# EAGLE schematic version 2 (EAGLE 6.1)

## Sheet 1 of 2
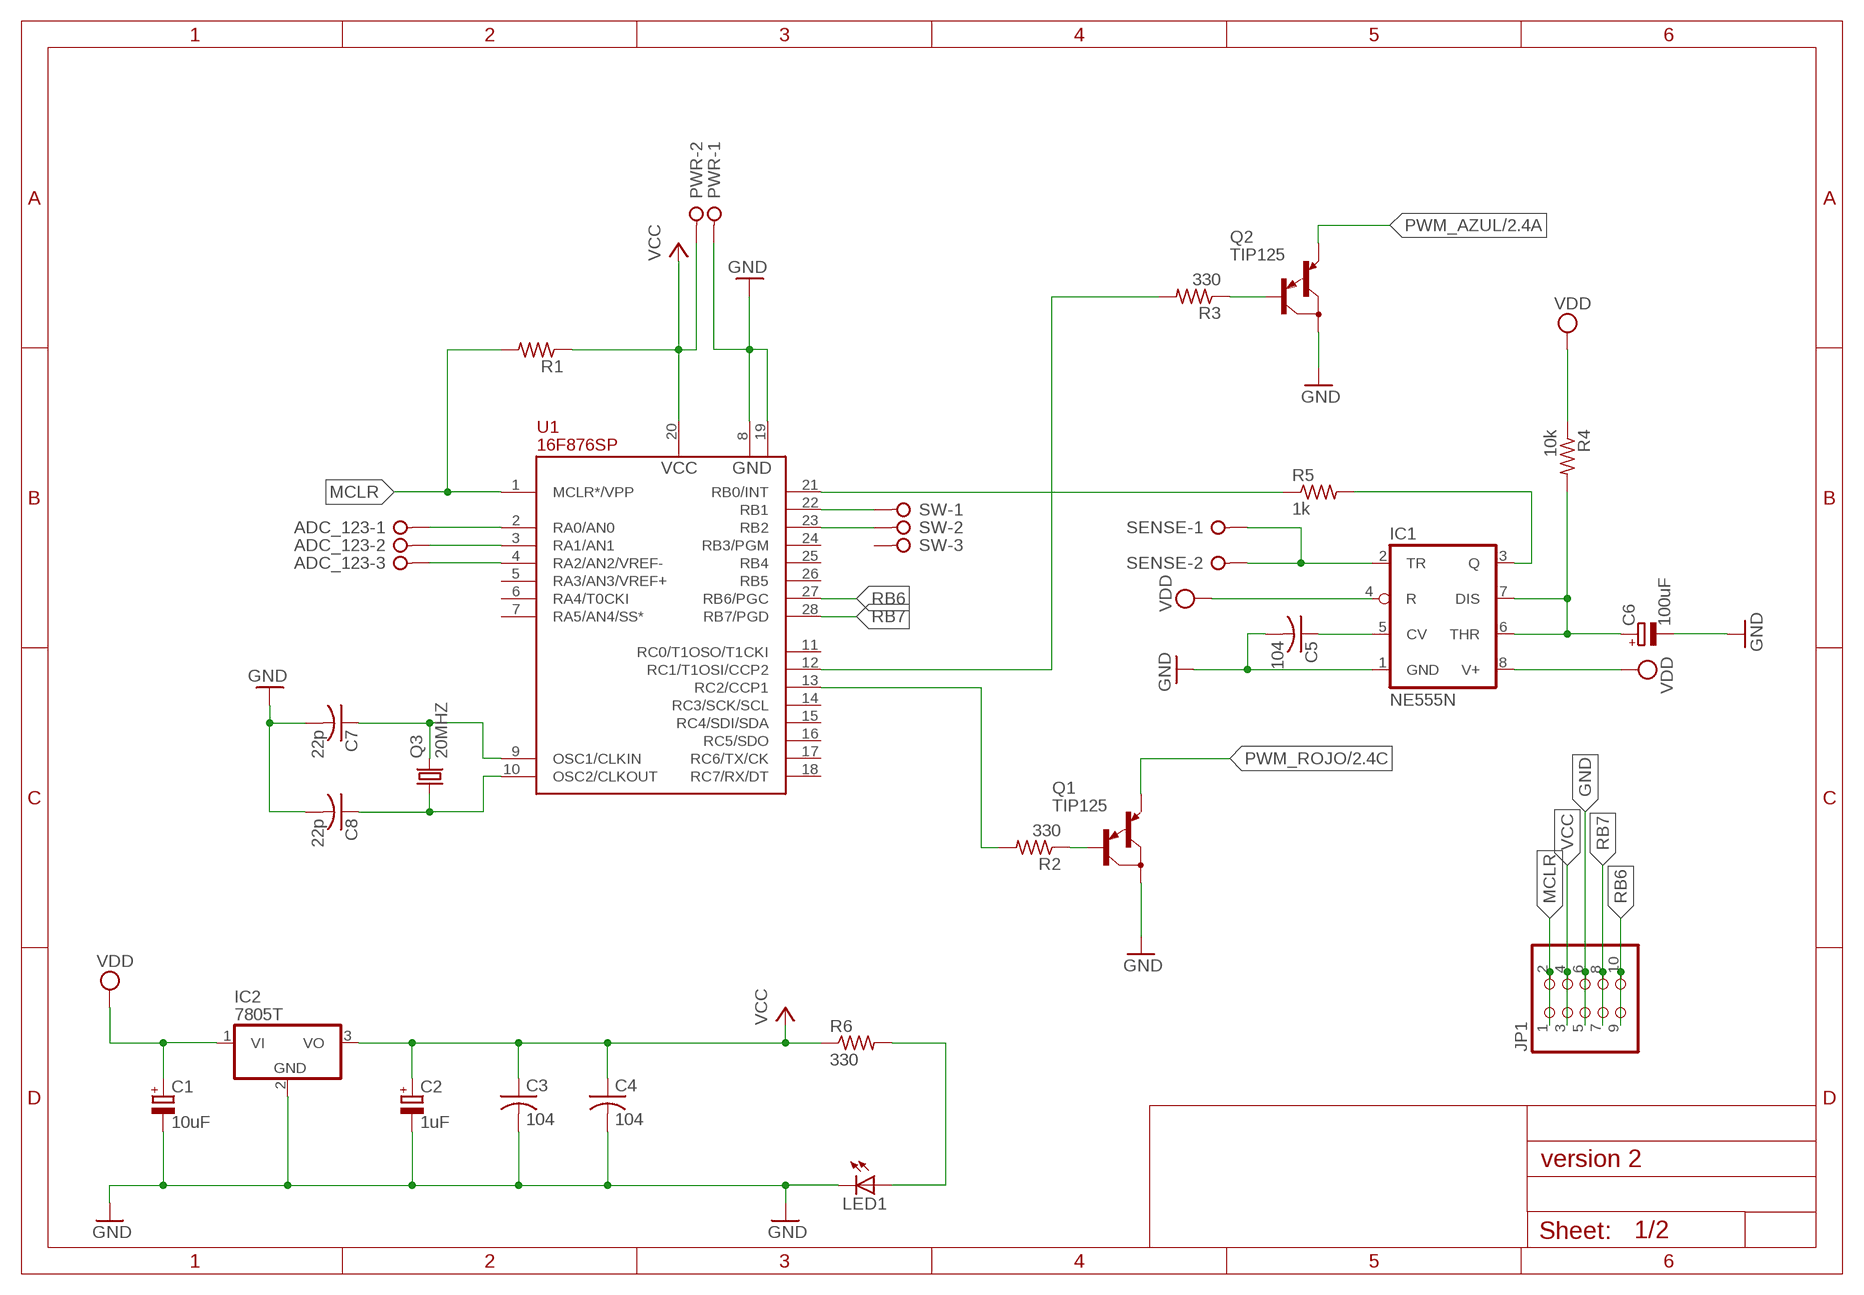
[diagram p0: schematic, sheet 1]

### Parts
ADC_123  W237-03P  [W237-133]
C1  10uF  CPOL-EUE2.5-6  [E2,5-6]
C2  1uF  CPOL-EUE2.5-6  [E2,5-6]
C3  104  C-US025-024X044  [C025-024X044]
C4  104  C-US025-024X044  [C025-024X044]
C5  104  C-US025-024X044  [C025-024X044]
C6  100uF  CPOL-EUE2.5-6  [E2,5-6]
C7  22p  C-US025-024X044  [C025-024X044]
C8  22p  C-US025-024X044  [C025-024X044]
IC1  NE555N  [DIL08]
IC2  7805T  [TO220H]
JP1  PINHD-2X5  [2X05]
LED1  LED3MM  [LED3MM]
PWR  W237-02P  [W237-132]
Q1  TIP125  [TO220]
Q2  TIP125  [TO220]
Q3  20MHZ  CRYSTALHC49S  [HC49/S]
R1  R-US_0204/7  [0204/7]
R2  330  R-US_0204/7  [0204/7]
R3  330  R-US_0204/7  [0204/7]
R4  10k  R-US_0204/7  [0204/7]
R5  1k  R-US_0204/7  [0204/7]
R6  330  R-US_0204/7  [0204/7]
SENSE  W237-02P  [W237-132]
SW  W237-03P  [W237-133]
U1  16F876SP  [DIL28-3]

### Nets
GND: C1.- C2.- C3.2 C4.2 C5.2 C6.- C7.2 C8.2 IC1.1(GND) IC2.2(GND) JP1.5 JP1.6 LED1.K(C) PWR.1 Q1.2(C) Q2.2(C) U1.8(GND) U1.19(GND) ; also sheet 2
MCLR: JP1.1 JP1.2 R1.2 U1.1(MCLR*/VPP)
N$1: C5.1 IC1.5(CV)
N$5: R2.2 U1.13(RC2/CCP1)
N$6: C6.+ IC1.6(THR) IC1.7(DIS) R4.2
N$7: IC1.3(Q) R5.2
N$8: R5.1 U1.21(RB0/INT)
N$9: Q1.1(B) R2.1
N$10: IC1.2(TR) SENSE.1 SENSE.2
N$11: R3.2 U1.12(RC1/T1OSI/CCP2)
N$12: Q2.1(B) R3.1
N$13: SW.1 U1.22(RB1)
N$14: SW.2 U1.23(RB2)
N$16: ADC_123.1 U1.2(RA0/AN0)
N$17: ADC_123.2 U1.3(RA1/AN1)
N$18: ADC_123.3 U1.4(RA2/AN2/VREF-)
N$21: LED1.A R6.2
N$23: C7.1 Q3.2 U1.9(OSC1/CLKIN)
N$24: C8.1 Q3.1 U1.10(OSC2/CLKOUT)
PWM_AZUL: Q2.3(E) ; also sheet 2
PWM_ROJO: Q1.3(E) ; also sheet 2
RB6: JP1.9 JP1.10 U1.27(RB6/PGC)
RB7: JP1.7 JP1.8 U1.28(RB7/PGD)
VCC: C2.+ C3.1 C4.1 IC2.3(VO) JP1.3 JP1.4 PWR.2 R1.1 R6.1 U1.20(VCC)
VDD: C1.+ IC1.4(R) IC1.8(V+) IC2.1(VI) R4.1 ; also sheet 2
Unconnected: SW.3 U1.5(RA3/AN3/VREF+) U1.6(RA4/T0CKI) U1.7(RA5/AN4/SS*) U1.11(RC0/T1OSO/T1CKI) U1.14(RC3/SCK/SCL) U1.15(RC4/SDI/SDA) U1.16(RC5/SDO) U1.17(RC6/TX/CK) U1.18(RC7/RX/DT) U1.24(RB3/PGM) U1.25(RB4) U1.26(RB5)

## Sheet 2 of 2
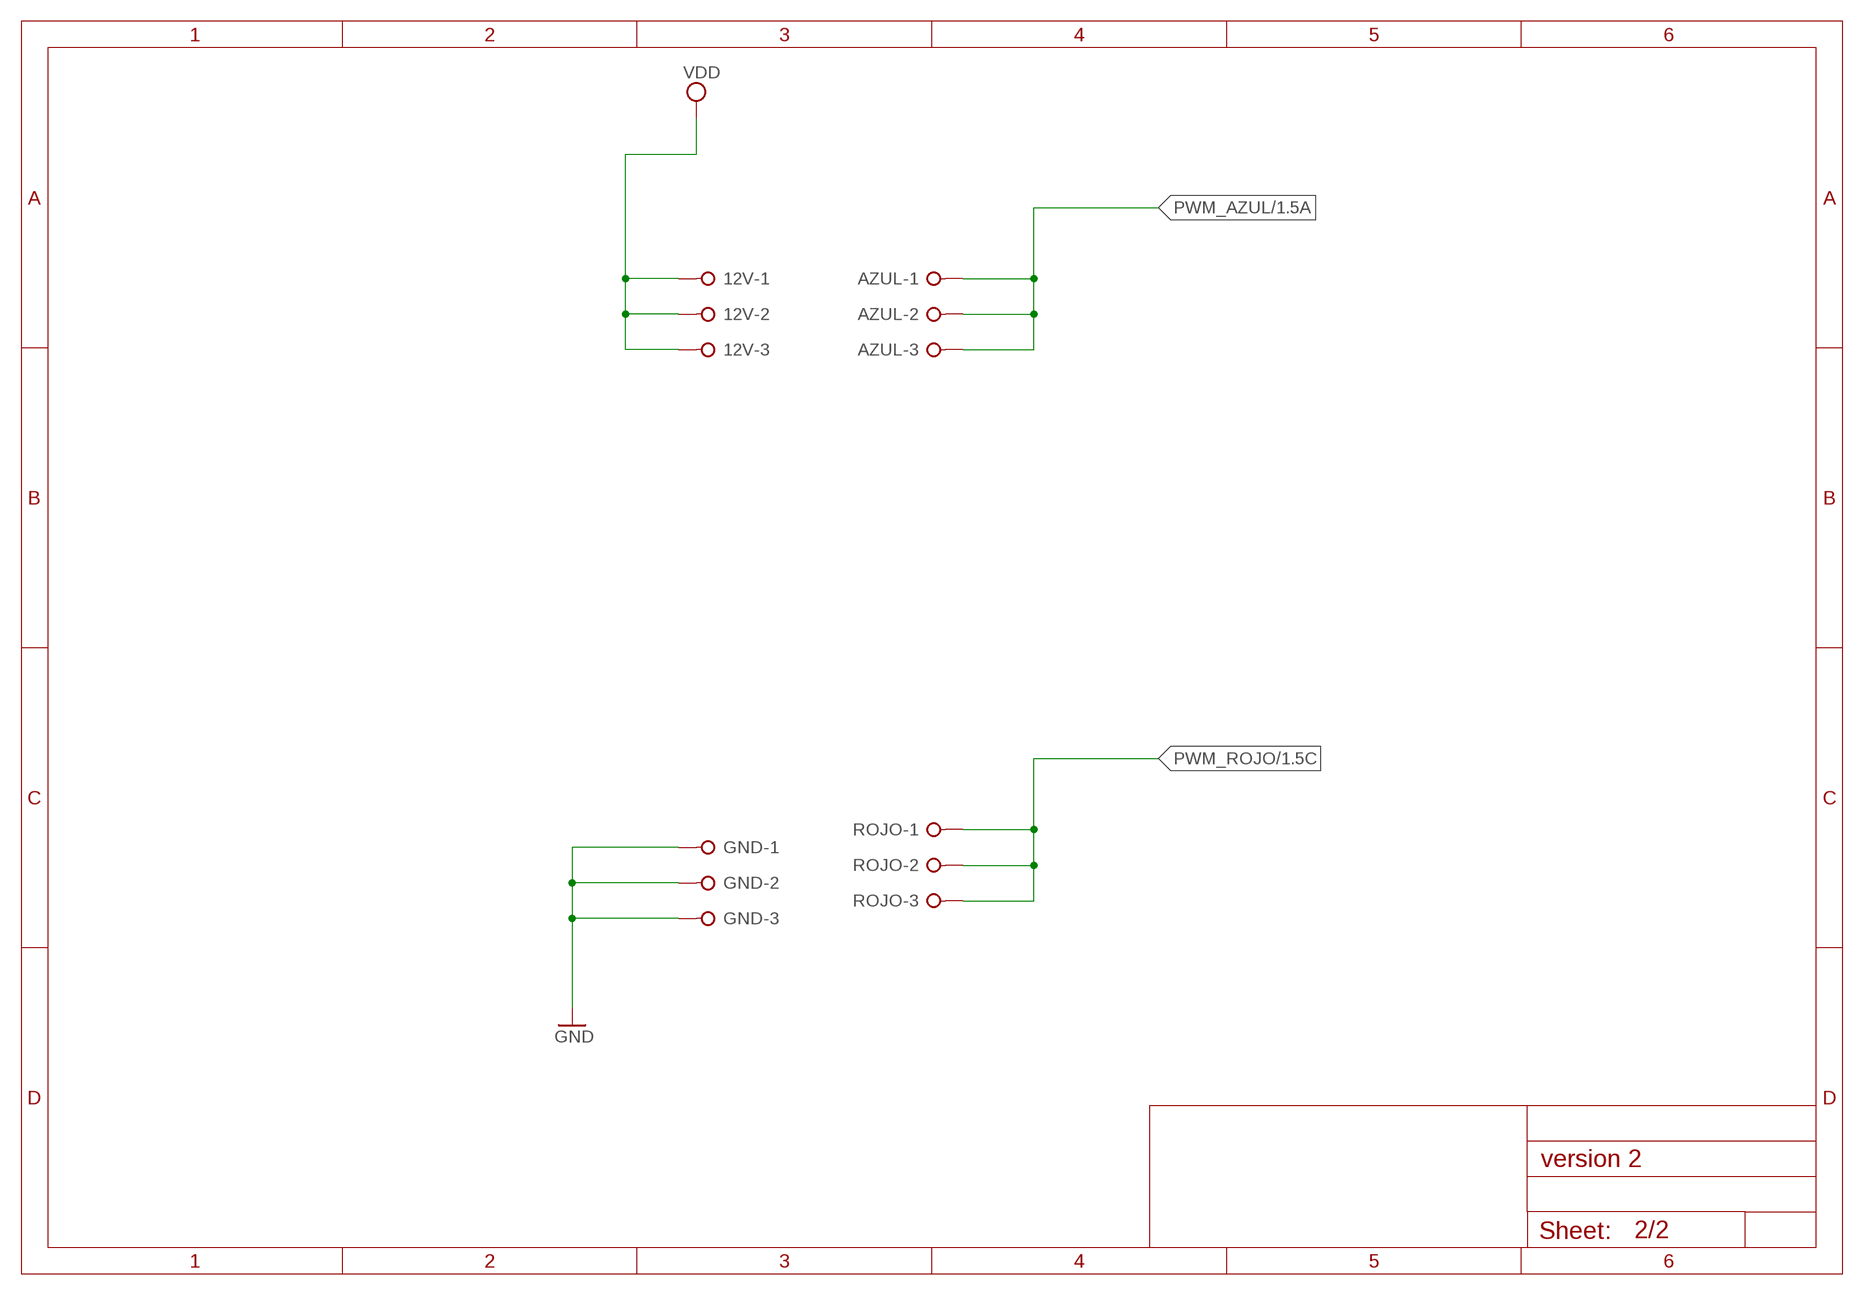
[diagram p1: schematic, sheet 2]

### Parts
12V  W237-03P  [W237-133]
AZUL  W237-03P  [W237-133]
GND  W237-03P  [W237-133]
ROJO  W237-03P  [W237-133]

### Nets
GND: GND.1 GND.2 GND.3 ; also sheet 1
PWM_AZUL: AZUL.1 AZUL.2 AZUL.3 ; also sheet 1
PWM_ROJO: ROJO.1 ROJO.2 ROJO.3 ; also sheet 1
VDD: 12V.1 12V.2 12V.3 ; also sheet 1

## Library data of the parts
12V ADC_123 AZUL GND ROJO SW = con-wago-508:W237-03P: WAGO SREW CLAMP; OC_FARNELL: unknown; OC_NEWARK: unknown
C1 C2 C6 = rcl:CPOL-EU: POLARIZED CAPACITOR, European symbol
C3-C5 C7 C8 = rcl:C-US: CAPACITOR, American symbol
IC1 = baiyun:*555: TIMER
IC2 = linear:78*: Positive VOLTAGE REGULATOR Source: http://cache.national.com/ds/LM/LM78L05.pdf http://www.fairchildsemi.com/ds/LM/LM7805.pdf
JP1 = pinhead:PINHD-2X5: PIN HEADER
LED1 = led:LED: LED OSRAM: - CHIPLED LG R971, LG N971, LY N971, LG Q971, LY Q971, LO R971, LY R971 LH N974, LH R974 LS Q976, LO Q976, LY Q976 LO Q996 - Hyper CHIPLED LW Q18S LB Q993, LB Q99A, LB R99A - SideLED LS A670, LO A670, LY A670, LG A670, LP A670 LB A673, LV A673, LT A673, LW A673 LH A674 LY A675 LS A676, LA A676, LO A676, LY A676, LW A676 LS A679, LY A679, LG A679 - Hyper Micro SIDELED® LS Y876, LA Y876, LO Y876, LY Y876 LT Y87S - SmartLED LW L88C, LW L88S LB L89C, LB L89S, LG L890 LS L89K, LO L89K, LY L89K LS L896, LA L896, LO L896, LY L896 - TOPLED LS T670, LO T670, LY T670, LG T670, LP T670 LSG T670, LSP T670, LSY T670, LOP T670, LYG T670 LG T671, LOG T671, LSG T671 LB T673, LV T673, LT T673, LW T673 LH T674 LS T676, LA T676, LO T676, LY T676, LB T676, LH T676, LSB T676, LW T676 LB T67C, LV T67C, LT T67C, LS T67K, LO T67K, LY T67K, LW E67C LS E67B, LA E67B, LO E67B, LY E67B, LB E67C, LV E67C, LT E67C LW T67C LS T679, LY T679, LG T679 LS T770, LO T770, LY T770, LG T770, LP T770 LB T773, LV T773, LT T773, LW T773 LH T774 LS E675, LA E675, LY E675, LS T675 LS T776, LA T776, LO T776, LY T776, LB T776 LHGB T686 LT T68C, LB T68C - Hyper Mini TOPLED® LB M676 - Mini TOPLED Santana® LG M470 LS M47K, LO M47K, LY M47K Source: http://www.osram.convergy.de LUXEON: - LUMILED® LXK2-PW12-R00, LXK2-PW12-S00, LXK2-PW14-U00, LXK2-PW14-V00 LXK2-PM12-R00, LXK2-PM12-S00, LXK2-PM14-U00 LXK2-PE12-Q00, LXK2-PE12-R00, LXK2-PE12-S00, LXK2-PE14-T00, LXK2-PE14-U00 LXK2-PB12-K00, LXK2-PB12-L00, LXK2-PB12-M00, LXK2-PB14-N00, LXK2-PB14-P00, LXK2-PB14-Q00 LXK2-PR12-L00, LXK2-PR12-M00, LXK2-PR14-Q00, LXK2-PR14-R00 LXK2-PD12-Q00, LXK2-PD12-R00, LXK2-PD12-S00 LXK2-PH12-R00, LXK2-PH12-S00 LXK2-PL12-P00, LXK2-PL12-Q00, LXK2-PL12-R00 Source: www.luxeon.com KINGBRIGHT: KA-3528ASYC Source: www.kingbright.com
PWR SENSE = con-wago-508:W237-02P: WAGO SREW CLAMP; OC_FARNELL: unknown; OC_NEWARK: unknown
Q1 Q2 = transistor-pnp:TIP125: PNP Transistor
Q3 = crystal:CRYSTAL: CRYSTAL; OC_FARNELL: 1667008; OC_NEWARK: unknown
R1-R6 = rcl:R-US_: RESISTOR, American symbol
U1 = -redpic-microchip-pic:16F876: Microchip PIC 16F876